# EAGLE design ESP Breakout Adapter - v3_0A - AS1363 - Mini (EAGLE 7.3.0)
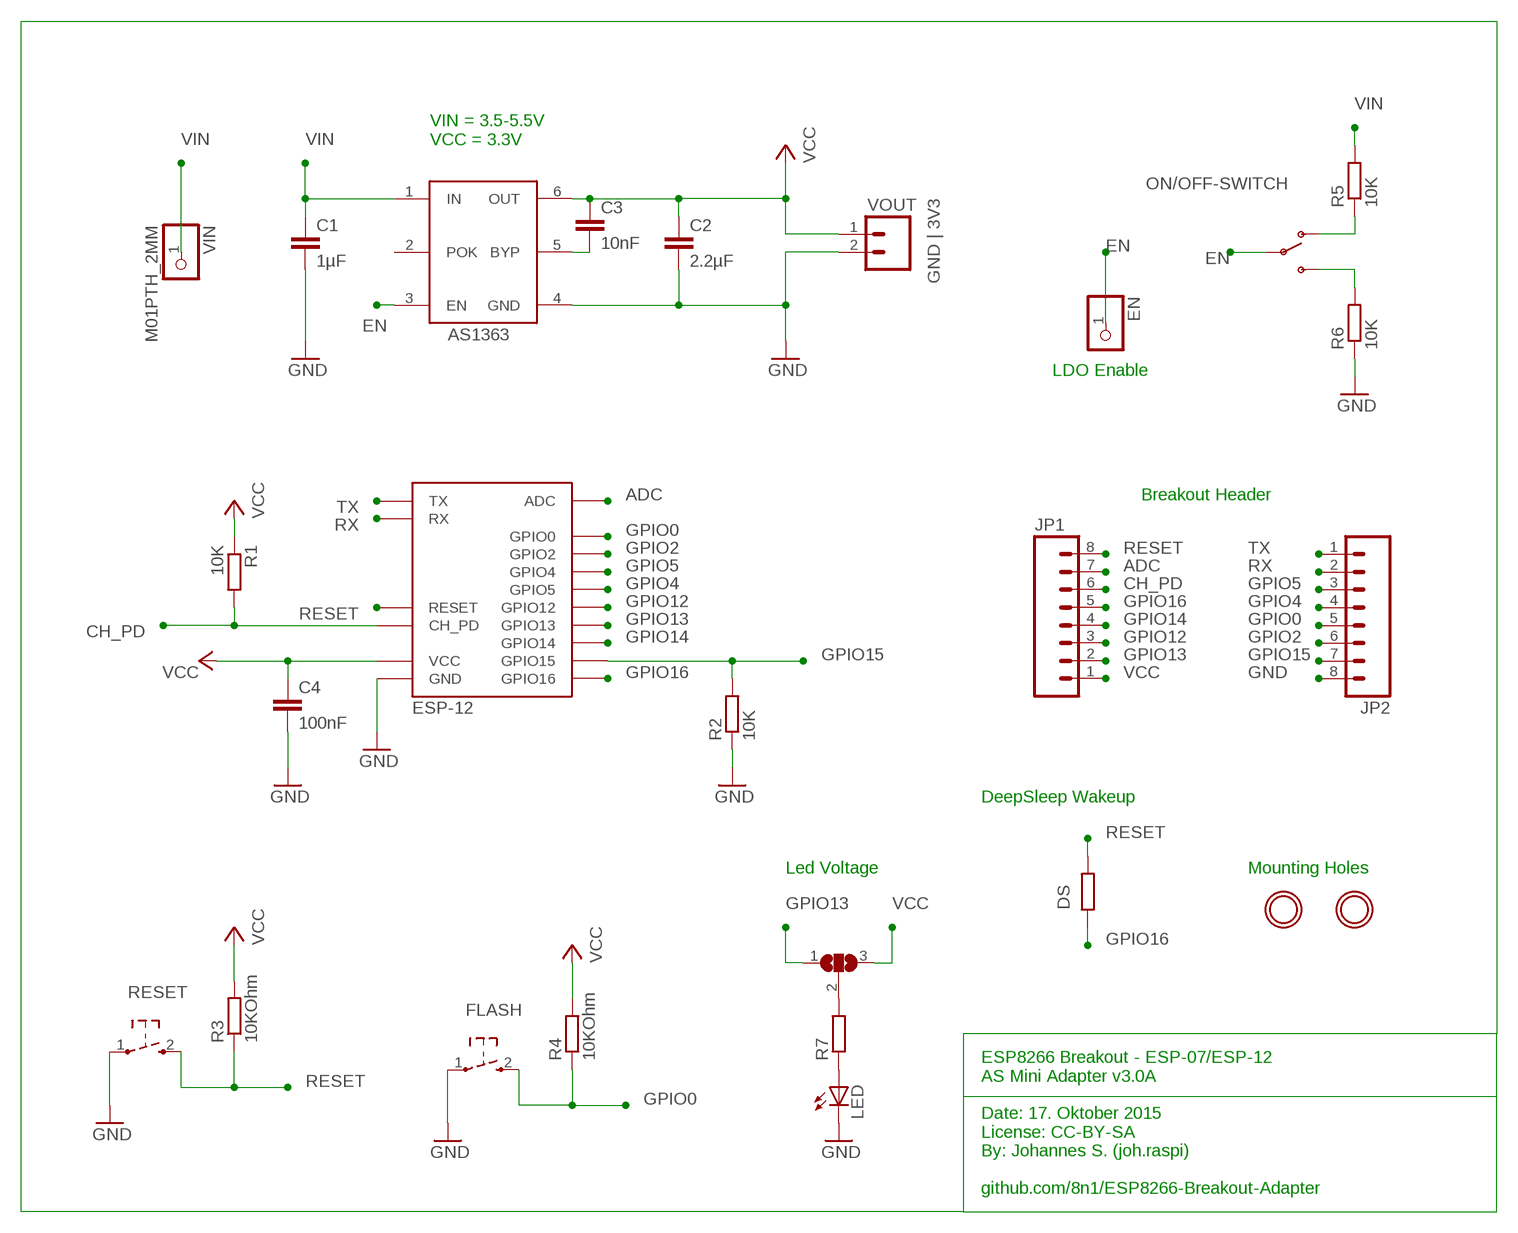
[diagram p0: schematic, sheet 1]

## Parts
AS1363  AS1363  [SOT23-6]
C1  1µF  C-EUC1206  [C1206]
C2  2.2µF  C-EUC1206  [C1206]
C3  10nF  C-EUC0603K  [C0603K]
C4  100nF  C-EUC0805  [C0805]
DS  R-EU_R0603  [R0603]
EN  PINHD-1X1  [1X01]
FLASH  SW_TACT_2P-3X6  [SW_TACT_3X6]
JP1  M081X08  [1X08]
JP2  M081X08  [1X08]
LED  LEDCHIPLED_0805  [CHIPLED_0805]
LED_VOLTAGE  SJ2W  [SJ_2]
ON/OFF-SWITCH  SWITCH_SPDT  [KPS-1290]
R1  10K  R-EU_R0805  [R0805]
R2  10K  R-EU_R0805  [R0805]
R3  10KOhm  R-EU_R0805  [R0805]
R4  10KOhm  R-EU_R0805  [R0805]
R5  10K  R-EU_R0805  [R0805]
R6  10K  R-EU_R0805  [R0805]
R7  R-EU_R0805  [R0805]
RESET  SW_TACT_2P-3X6  [SW_TACT_3X6]
U$1  ESP-12  [ESP-12]
U$4  MOUNTINGHOLE2.0  [MOUNTINGHOLE_2.0_PLATED]
U$5  MOUNTINGHOLE2.0  [MOUNTINGHOLE_2.0_PLATED]
VIN  M01PTH_2MM  PINHD-1X1CB  [1X01-CLEANBIG]
VOUT  GND | 3V3  M02PTH  [1X02]

## Nets
123: ON/OFF-SWITCH.S R6.2
ADC: JP1.7 U$1.ADC
CH_PD: JP1.6 R1.2 U$1.CH_PD
EN: AS1363.3(EN) EN.1 ON/OFF-SWITCH.P
GND [a]: AS1363.4(GND) C1.2 C2.2 C4.2 FLASH.1 JP2.8 LED.C R2.1 R6.1 RESET.1 U$1.GND VOUT.2
GPIO0: FLASH.2 JP2.5 R4.1 U$1.GPIO0
GPIO2: JP2.6 U$1.GPIO2
GPIO4: JP2.4 U$1.GPIO5
GPIO5: JP2.3 U$1.GPIO4
GPIO12: JP1.3 U$1.GPIO12
GPIO13: JP1.2 LED_VOLTAGE.1 U$1.GPIO13
GPIO14: JP1.4 U$1.GPIO14
GPIO15: JP2.7 R2.2 U$1.GPIO15
GPIO16: DS.1 JP1.5 U$1.GPIO16
N$2: LED_VOLTAGE.2 R7.2
N$3: ON/OFF-SWITCH.O R5.1
N$5: LED.A R7.1
RESET: DS.2 JP1.8 R3.1 RESET.2 U$1.RESET
RX: JP2.2 U$1.RX
SET/BYP: AS1363.5(BYP) C3.2
TX: JP2.1 U$1.TX
VCC: AS1363.6(OUT) C2.1 C3.1 C4.1 JP1.1 LED_VOLTAGE.3 R1.1 R3.2 R4.2 U$1.VCC VOUT.1
VIN: AS1363.1(IN) C1.1 R5.2 VIN.1
Unconnected: AS1363.2(POK)

## Notes on the sheet
- VIN = 3.5-5.5V
  VCC = 3.3V
- LDO Enable
- Breakout Header
- DeepSleep Wakeup
- Led Voltage | Mounting Holes
- ESP8266 Breakout - ESP-07/ESP-12
  AS Mini Adapter v3.0A
  
  Date: 17. Oktober 2015
  License: CC-BY-SA
  By: Johannes S. (joh.raspi)
  
  github.com/8n1/ESP8266-Breakout-Adapter

## Library data of the parts
AS1363 = joh_as1363:AS1363: 500mA ultra-low-dropout linear regulator 1.2V-5V 40µA quiescen current Source: http://ams.com/eng/content/download/12507/219217/12422
C1 = resistor:C-EU: CAPACITOR, European symbol
C2-C4 = rcl:C-EU: CAPACITOR, European symbol
DS R5-R7 = resistor:R-EU_: RESISTOR, European symbol
EN = pinhead:PINHD-1X1: PIN HEADER
FLASH RESET = dp-devices:SW_TACT_2P
JP1 JP2 = SparkFun:M08: Header 8 Standard 8-pin 0.1" header. Use with straight break away headers (SKU : PRT-00116), right angle break away headers (PRT-00553), swiss pins (PRT-00743), machine pins (PRT-00117), and female headers (PRT-00115).
LED = adafruit:LED: LED OSRAM: - CHIPLED LG R971, LG N971, LY N971, LG Q971, LY Q971, LO R971, LY R971 LH N974, LH R974 LS Q976, LO Q976, LY Q976 LO Q996 - Hyper CHIPLED LW Q18S LB Q993, LB Q99A, LB R99A - SideLED LS A670, LO A670, LY A670, LG A670, LP A670 LB A673, LV A673, LT A673, LW A673 LH A674 LY A675 LS A676, LA A676, LO A676, LY A676, LW A676 LS A679, LY A679, LG A679 - Hyper Micro SIDELED® LS Y876, LA Y876, LO Y876, LY Y876 LT Y87S - SmartLED LW L88C, LW L88S LB L89C, LB L89S, LG L890 LS L89K, LO L89K, LY L89K LS L896, LA L896, LO L896, LY L896 - TOPLED LS T670, LO T670, LY T670, LG T670, LP T670 LSG T670, LSP T670, LSY T670, LOP T670, LYG T670 LG T671, LOG T671, LSG T671 LB T673, LV T673, LT T673, LW T673 LH T674 LS T676, LA T676, LO T676, LY T676, LB T676, LH T676, LSB T676, LW T676 LB T67C, LV T67C, LT T67C, LS T67K, LO T67K, LY T67K, LW E67C LS E67B, LA E67B, LO E67B, LY E67B, LB E67C, LV E67C, LT E67C LW T67C LS T679, LY T679, LG T679 LS T770, LO T770, LY T770, LG T770, LP T770 LB T773, LV T773, LT T773, LW T773 LH T774 LS E675, LA E675, LY E675, LS T675 LS T776, LA T776, LO T776, LY T776, LB T776 LHGB T686 LT T68C, LB T68C - Hyper Mini TOPLED® LB M676 - Mini TOPLED Santana® LG M470 LS M47K, LO M47K, LY M47K Source: http://www.osram.convergy.de/
LED_VOLTAGE = jumper:SJ2W: SMD solder JUMPER
ON/OFF-SWITCH = SparkFun-Electromechanical:SWITCH_SPDT: SWCH-10651 Side-actuated SPDT slide switch, as used on the Arduino Pro; PROD_ID: SWCH-10651
R1-R4 = rcl:R-EU_: RESISTOR, European symbol
U$1 = johs_esp8266_lib_frank_esp12e_mod:ESP-12: ESP8266 Wifi Module ESP-12; DIMENSIONS: 24.0 x 16.0 mm; PINS: 16; PITCH: 0.078" / 2 mm
U$4 U$5 = microbuilder:MOUNTINGHOLE: Mounting Hole For #2 screws (0.086"/2.18mm width, 0.094"/2.4mm hole) use 2.5mm
VIN = adafruit:PINHD-1X1: Pin header 1x1 for 0.1" spacing With round pins
VOUT = SparkFun:M02: Header 2 Standard 2-pin 0.1" header. Use with straight break away headers (SKU : PRT-00116), right angle break away headers (PRT-00553), swiss pins (PRT-00743), machine pins (PRT-00117), and female headers (PRT-00115). Molex polarized connector foot print use with SKU : PRT-08233 with associated crimp pins and housings.

## Net classes
1 a: width 0.203 mm, drill 0.305 mm, clearance 0.203 mm

## Board
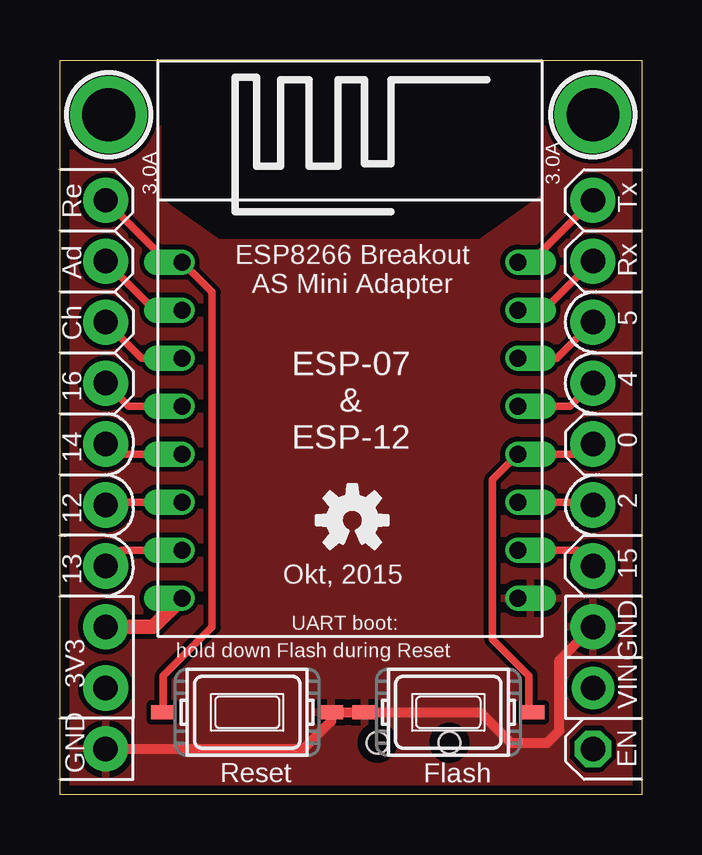
[diagram p1: board, top side]
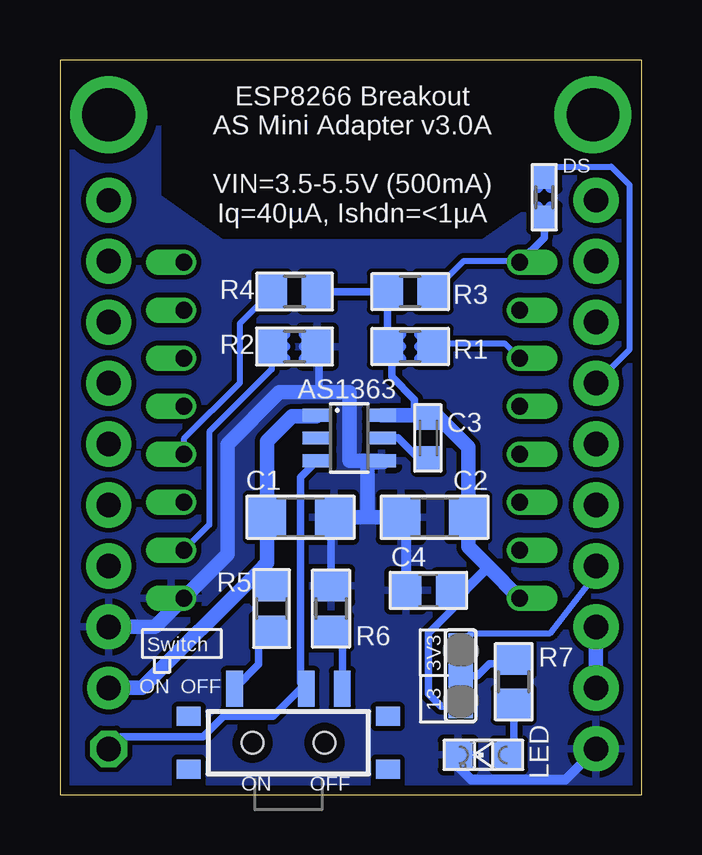
[diagram p2: board, bottom side, seen from below]

Size 24.26 x 30.61 mm. Coordinates in mm from the lower left corner, seen from the top.
Outline: 0,0 0,30.61 24.26,30.61 24.26,0 0,0
Copper layers (1*16): Top 0.0356mm / dielectric 1.5011mm / Bottom 0.0356mm
Design rules "LaenPCBOrder": minimum track width 6mil, minimum drill 13mil, track to track 6mil, track to pad 6mil, pad to pad 6mil, via to via 6mil, smd to smd 6mil, copper to edge 15mil, drill to drill 6mil, minimum pad ring 7mil, minimum via ring 7mil, stop-mask expansion 3mil, vias tented up to drill 0mil, thermal gap 10mil

### Footprints (pad centres in the part's own frame; a part is rotated, then mirrored left to right if it is on the bottom)
SOT23-6 = smd 0.533 x 1.219: 1 -0.95,-1.341; 2 0,-1.341; 3 0.95,-1.341; 4 0.95,1.341; 5 0,1.341; 6 -0.95,1.341
C1206 = smd 1.6 x 1.8: 1 -1.4,0; 2 1.4,0
C0603K = smd 1.05 x 1.08: 1 -0.875,0; 2 0.875,0
C0805 = smd 1.3 x 1.5: 1 -0.95,0; 2 0.95,0
R0603 = smd 1 x 1.1: 1 -0.85,0; 2 0.85,0
1X01 = drill 1.016 octagon: 1 0,0
SW_TACT_3X6 = smd 1 x 0.6: 1 -3.5,0; 2 3.5,0
1X08 = drill 1.016 pad 1.88: 1 0,0; 2 2.54,0; 3 5.08,0; 4 7.62,0; 5 10.16,0; 6 12.7,0; 7 15.24,0; 8 17.78,0
CHIPLED_0805 = smd 1.2 x 1.2: A 0,-1.05; C 0,1.05
SJ_2 = smd 1.016 x 1.016: 1 -1.27,0; 2 0,0; 3 1.27,0
KPS-1290 = smd 0.7 x 1.5: O -2.25,2.25; P 0.75,2.25; S 2.25,2.25 | smd 1 x 0.8: P$1 -4.15,1.1; P$2 -4.15,-1.1; P$3 4.15,-1.1; P$4 4.15,1.1 | hole 0.9: -1.5,0; 1.5,0
R0805 = smd 1.3 x 1.5: 1 -0.95,0; 2 0.95,0
ESP-12 = drill 0.7 offset: ADC -7.1,3.8; CH_PD -7.1,1.8; GND 6.9,-8.2; GPIO0 6.9,-2.2; GPIO2 6.9,-4.2; GPIO4 6.9,1.8; GPIO5 6.9,-0.2; GPIO12 -7.1,-4.2; GPIO13 -7.1,-6.2; GPIO14 -7.1,-2.2; GPIO15 6.9,-6.2; GPIO16 -7.1,-0.2; RESET -7.1,5.8; RX 6.9,3.8; TX 6.9,5.8; VCC -7.1,-8.2
MOUNTINGHOLE_2.0_PLATED = drill 2.2 pad 3: P$1 0,0
1X01-CLEANBIG = drill 1.016 pad 1.778: 1 0,0
1X02 = drill 1.016 pad 1.88: 1 0,0; 2 2.54,0

### Placement (x,y rotation side)
AS1363  12.19,14.86 270 bottom
C1  14.22,11.56 0 bottom
C2  8.64,11.56 180 bottom
C3  8.89,14.86 270 bottom
C4  8.89,8.51 180 bottom
DS  4.06,24.89 270 bottom
EN  22.22,1.91 0 top
FLASH  16.19,3.43 0 top
JP1  1.9,6.99 90 top
JP2  22.22,24.77 270 top
LED  6.6,1.65 90 bottom
LED_VOLTAGE  7.55,4.95 270 bottom
ON/OFF-SWITCH  14.73,2.16 0 bottom
R1  9.65,18.67 0 bottom
R2  14.48,18.67 180 bottom
R3  9.65,20.96 180 bottom
R4  14.48,20.96 0 bottom
R5  15.43,7.75 90 bottom
R6  12.95,7.75 270 bottom
R7  5.33,4.7 90 bottom
RESET  7.81,3.43 180 top
U$1  12.19,16.38 0 top
U$2  [OSHW-LOGO-S]  12.19,11.43 0 top
U$4  2.03,28.32 0 top
U$5  22.22,28.32 0 top
VIN  22.22,4.45 0 top
VOUT  1.9,4.44 270 top

### Tracks (layer width: path | path; a pad name or v marks a point on that pad's centre or on a via)
123
  Bottom 0.305: ON/OFF-SWITCH.S 12.48,6.33 R6.2
ADC
  Top 0.305: U$1.ADC 3.95,20.18 JP1.7
CH_PD
  Top 0.305: U$1.CH_PD 3.41,18.18 JP1.6
  Bottom 0.254: U$1.CH_PD 5.71,18.8 8.6,18.8 8.6,18.78 R1.2
  Bottom 0.305: 9.14,19.18 9.14,19.11 | 9.14,19.11 R1.2 | 9.14,19.11 9.14,18.67 9.14,18.16
  Bottom 0.406: 9.14,19.18 9.27,19.18 | 9.14,18.67 9.27,18.67 | 9.14,18.16 9.27,18.16
EN
  Bottom 0.305: EN.1 21.72,2.41 18.29,2.41 17.43,3.27 15.37,3.27 13.98,4.65 ON/OFF-SWITCH.P 14.22,4.65 14.22,13.22 AS1363.3
GND
  Top 0.406: VOUT.2 10.16,1.9 11.31,3.05 RESET.1 FLASH.1 17.53,3.43 18.8,2.16 20.32,2.16 20.83,2.67 20.83,5.59 JP2.8
  Bottom 0.254: R2.1 13.46,18.6
  Bottom 0.305: 13.46,18.6 13.46,16.76 | C1.2 12.95,11.43 R6.1 | 13.97,18.67 13.97,19.18 | 13.97,18.67 13.97,18.16 | R2.1 13.97,18.67
  Bottom 0.406: 13.97,19.18 14.1,19.18 | 13.97,18.67 14.1,18.67 | 13.97,18.16 14.1,18.16 | C2.2 9.84,11.36 C4.2 | LED.C 7.65,1.18 7.11,0.64 3.17,0.64 VOUT.2
  Bottom 0.61: C2.2 11.43,11.56 | 11.43,11.56 C1.2 | 11.43,11.56 11.43,13.85 10.8,13.85 AS1363.4 12.19,13.91 12.19,16.76 13.46,16.76 15.11,16.76 17.27,14.6 17.27,10 U$1.GND 20.29,6.99 JP2.8
  pour Top: 0.13,0 24.13,0 24.13,30.48 20.19,30.48 20.19,24.89 17.53,22.99 6.6,22.99 4.06,24.77 4.06,30.48 0.13,30.48
  pour Bottom: 0.13,0 24.13,0 24.13,30.48 20.19,30.48 20.19,24.89 17.53,22.99 6.6,22.99 4.06,24.77 4.06,30.48 0.13,30.48
GPIO0
  Top 0.305: JP2.5 21.8,14.18 U$1.GPIO0 18.03,13.12 18.03,6.48 19.56,4.95 19.56,3.56 FLASH.2
  Bottom 0.254: R4.1 16.76,19.62 16.76,17.14 19.09,14.82 U$1.GPIO0
GPIO2
  Top 0.305: JP2.6 22.11,12.18 U$1.GPIO2
GPIO4
  Top 0.305: JP2.4 21.26,16.18 U$1.GPIO5
GPIO5
  Top 0.305: JP2.3 20.72,18.18 U$1.GPIO4
GPIO12
  Top 0.305: U$1.GPIO12 2.02,12.18 JP1.3
GPIO13
  Top 0.305: U$1.GPIO13 2.56,10.18 JP1.2
  Bottom 0.254: JP1.2 2.03,9.4 2.03,9.02 3.81,6.73 7.11,6.73 7.55,6.3 LED_VOLTAGE.1
GPIO14
  Top 0.305: U$1.GPIO14 2.33,14.18 JP1.4
GPIO15
  Top 0.305: JP2.7 21.57,10.18 U$1.GPIO15
  Bottom 0.254: U$1.GPIO15 18.03,11.24 18.03,15.11 15.43,17.72 R2.2
  Bottom 0.305: R2.2 14.99,18.67 | 14.99,18.16 14.99,18.54 14.86,18.67 14.99,18.8 14.99,19.18
  Bottom 0.406: 14.86,19.18 14.99,19.18 | 14.86,18.67 14.99,18.67 | 14.86,18.16 14.99,18.16
GPIO16
  Top 0.305: U$1.GPIO16 2.87,16.18 JP1.5
  Bottom 0.254: JP1.5 0.51,18.54 0.51,25.4 1.27,26.16 4.19,26.16 4.19,25.87 DS.1 | 4.32,26.04 4.32,26 DS.1 | 4.26,25.78 4.1,25.78 DS.1
  Bottom 0.305: 3.81,25.78 4.26,25.78
  Bottom 0.406: 3.81,25.27 3.81,25.78 | 4.32,25.27 4.32,26.04
N$2
  Bottom 0.305: LED_VOLTAGE.2 6.86,4.95 6.35,5.46 5.52,5.46 R7.2
N$3
  Bottom 0.305: R5.1 15.66,6.57 15.97,6.57 15.97,5.42 ON/OFF-SWITCH.O
N$5
  Bottom 0.305: R7.1 5.33,1.87 LED.A
RESET
  Top 0.305: JP1.8 4.49,22.18 U$1.RESET 6.35,20.93 6.35,6.99 4.31,4.95 RESET.2
  Bottom 0.254: U$1.RESET 5.15,22.24 7.41,22.24 R3.1
  Bottom 0.305: DS.2 4.06,23.21 U$1.RESET
  Bottom 0.406: 3.81,24.51 3.81,24.26 4.03,24.04 DS.2 4.32,24.3 4.32,24.51
RX
  Top 0.305: JP2.2 20.18,20.18 U$1.RX
SET/BYP
  Bottom 0.305: AS1363.5 10.16,14.86 9.29,13.98 C3.2
TX
  Top 0.305: 19.13,22.23 U$1.TX 19.64,22.18 JP2.1
VCC
  Top 0.61: 4.56,8.24 5.03,8.24 U$1.VCC 3.89,6.99 JP1.1
  Bottom 0.254: 10.41,18.86 R1.1
  Bottom 0.305: 9.47,15.81 9.47,16.46 10.41,17.4 10.41,18.67 | 10.41,18.67 10.41,18.86 | R4.2 R3.2 R1.1 10.41,18.67 | 10.03,19.18 10.16,19.18 10.16,18.67 10.16,18.16 | LED_VOLTAGE.3 8.38,3.68 8.89,4.19 8.89,6.73 7.87,7.75 7.87,8.44 C4.1
  Bottom 0.406: 10.03,19.18 10.41,19.18 | 10.03,18.67 10.16,18.67 10.41,18.67 | 10.03,18.16 10.16,18.16 10.41,18.16 | C4.1 7.37,8.51 6.39,9.48
  Bottom 0.61: AS1363.6 9.47,15.81 8.89,15.81 C3.1 8.5,15.73 7.24,14.47 C2.1 7.24,10.33 6.39,9.48 U$1.VCC | JP1.1 VOUT.1
VIN
  Bottom 0.406: 13.57,15.77 AS1363.1
  Bottom 0.61: 13.57,15.77 14.58,15.77 15.62,14.73 C1.1 15.62,9.65 16,9.27 | VIN.1 21.72,4.45 20.82,4.45 16,9.27 | R5.2 16,9.27

### Text on the board
tPlace: 3.0A | Tx | 3.0A | Re | ESP8266 Breakout / AS Mini Adapter | Rx | Ad | 5 | Ch | 4 | 16 | 0 | 14 | 2 | 12 | 15 | 13 | Okt, 2015 | GND | UART boot: | hold down Flash during Reset | VIN | 3V3 | EN | GND | Reset | Flash
bPlace: ESP8266 Breakout / AS Mini Adapter v3.0A / / VIN=3.5-5.5V (500mA) / Iq=40µA, Ishdn=<1µA | AS1363 | Switch | 3V3 | OFF | ON | 13 | OFF | ON